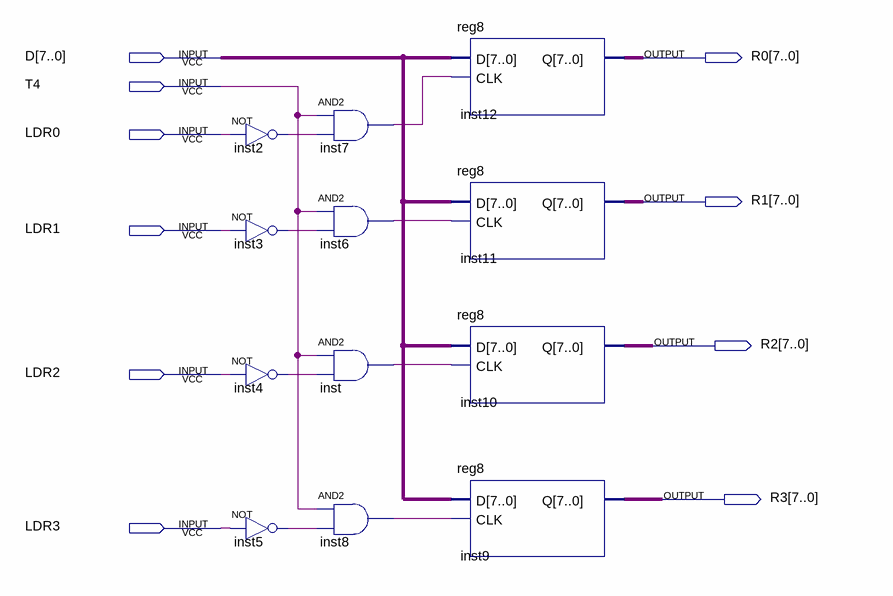
[diagram p0: schematic sheet]
// Quartus schematic Registers_3.bdf as structural Verilog: 12 symbols, 10 pins
module Registers_3 (
  input  [7:0] D,
  input  T4,
  input  LDR0,
  input  LDR1,
  input  LDR2,
  input  LDR3,
  output [7:0] R0,
  output [7:0] R1,
  output [7:0] R2,
  output [7:0] R3
);

  wire inst2_out, inst3_out, inst4_out, inst5_out, inst6_out, inst7_out, inst8_out, inst_out;

  not inst2 (inst2_out, LDR0);
  not inst3 (inst3_out, LDR1);
  not inst4 (inst4_out, LDR2);
  not inst5 (inst5_out, LDR3);
  and inst7 (inst7_out, T4, inst2_out);
  and inst6 (inst6_out, T4, inst3_out);
  and inst (inst_out, T4, inst4_out);
  and inst8 (inst8_out, T4, inst5_out);
  reg8 inst12 (.D(D), .CLK(inst7_out), .Q(R0));
  reg8 inst11 (.D(D), .CLK(inst6_out), .Q(R1));
  reg8 inst10 (.D(D), .CLK(inst_out), .Q(R2));
  reg8 inst9 (.D(D), .CLK(inst8_out), .Q(R3));
endmodule
